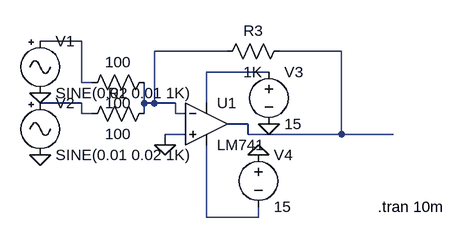
[diagram p0: schematic op amp part 2(summer).asc]
op amp part 2(summer).asc, the LTspice schematic file:
Version 4
SHEET 1 880 680
WIRE -16 32 -80 32
WIRE 208 48 96 48
WIRE 384 48 288 48
WIRE 272 80 176 80
WIRE -16 96 -16 32
WIRE 0 96 -16 96
WIRE -16 128 -80 128
WIRE 80 128 80 96
WIRE 96 128 96 48
WIRE 96 128 80 128
WIRE 128 128 96 128
WIRE 176 128 176 80
WIRE -16 144 -16 128
WIRE 0 144 -16 144
WIRE 80 144 80 128
WIRE 128 144 128 128
WIRE 144 144 128 144
WIRE 240 160 208 160
WIRE 144 176 112 176
WIRE 240 176 240 160
WIRE 384 176 384 48
WIRE 384 176 240 176
WIRE 464 176 384 176
WIRE 112 192 112 176
WIRE 176 304 176 192
WIRE 256 304 256 288
WIRE 256 304 176 304
FLAG 112 192 0
FLAG 256 208 0
FLAG 272 160 0
FLAG -80 112 0
FLAG -80 208 0
SYMBOL LM741 176 96 R0
SYMATTR InstName U1
SYMBOL res 96 80 R90
WINDOW 0 0 56 VBottom 2
WINDOW 3 32 56 VTop 2
SYMATTR InstName 100
SYMATTR Value 100
SYMBOL res 96 128 R90
WINDOW 0 0 56 VBottom 2
WINDOW 3 32 56 VTop 2
SYMATTR InstName R2
SYMATTR Value 100
SYMBOL res 304 32 R90
WINDOW 0 0 56 VBottom 2
WINDOW 3 32 56 VTop 2
SYMATTR InstName R3
SYMATTR Value 1K
SYMBOL Misc/signal -80 16 R0
SYMATTR InstName V1
SYMATTR Value SINE(0.01 0.01 1K)
SYMBOL Misc/signal -80 112 R0
SYMATTR InstName V2
SYMATTR Value SINE(0.01 0.02 1K)
SYMBOL voltage 272 64 R0
SYMATTR InstName V3
SYMATTR Value 15
SYMBOL voltage 256 192 R0
SYMATTR InstName V4
SYMATTR Value 15
TEXT 440 288 Left 2 !.tran 10m

The netlist it stands for:
* op amp part 2(summer).asc
XU1 0 N002 N004 N006 N003 LM741  ; pins In+ In- V+ V- OUT
R§100 N002 N001 100
R2 N002 N005 100
R3 N003 N002 1K
V1 N001 0 SINE(0.01 0.01 1K)
V2 N005 0 SINE(0.01 0.02 1K)
V3 N004 0 15
V4 0 N006 15
.tran 10m
.lib LM741.lib
.backanno
.end